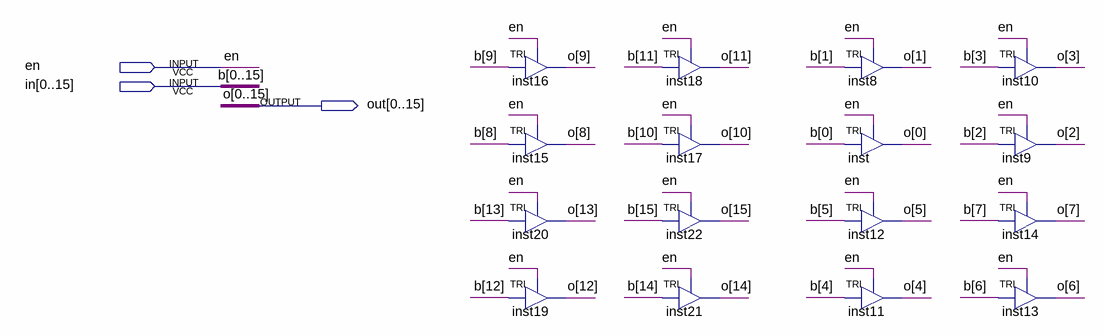
[diagram p0: schematic sheet]
// Quartus schematic tri16.bdf as structural Verilog: 16 symbols, 3 pins
module tri16 (
  input  en,
  input  [0:15] in,
  output [0:15] out
);

  TRI inst16 (.IN(in[9]), .OE(en), .OUT(out[9]));
  TRI inst15 (.IN(in[8]), .OE(en), .OUT(out[8]));
  TRI inst20 (.IN(in[13]), .OE(en), .OUT(out[13]));
  TRI inst19 (.IN(in[12]), .OE(en), .OUT(out[12]));
  TRI inst18 (.IN(in[11]), .OE(en), .OUT(out[11]));
  TRI inst17 (.IN(in[10]), .OE(en), .OUT(out[10]));
  TRI inst22 (.IN(in[15]), .OE(en), .OUT(out[15]));
  TRI inst21 (.IN(in[14]), .OE(en), .OUT(out[14]));
  TRI inst8 (.IN(in[1]), .OE(en), .OUT(out[1]));
  TRI inst (.IN(in[0]), .OE(en), .OUT(out[0]));
  TRI inst12 (.IN(in[5]), .OE(en), .OUT(out[5]));
  TRI inst11 (.IN(in[4]), .OE(en), .OUT(out[4]));
  TRI inst10 (.IN(in[3]), .OE(en), .OUT(out[3]));
  TRI inst9 (.IN(in[2]), .OE(en), .OUT(out[2]));
  TRI inst14 (.IN(in[7]), .OE(en), .OUT(out[7]));
  TRI inst13 (.IN(in[6]), .OE(en), .OUT(out[6]));

  // Other names for the same wires on the sheet: b[15:0] = {in[15], in[14], in[13], in[12], in[11], in[10], in[9], in[8], in[7], in[6], in[5], in[4], in[3], in[2], in[1], in[0]};
  //   o[15:0] = {out[15], out[14], out[13], out[12], out[11], out[10], out[9], out[8], out[7], out[6], out[5], out[4], out[3], out[2], out[1], out[0]}
endmodule
